# EAGLE schematic MPPT3 (EAGLE 7.2.0)
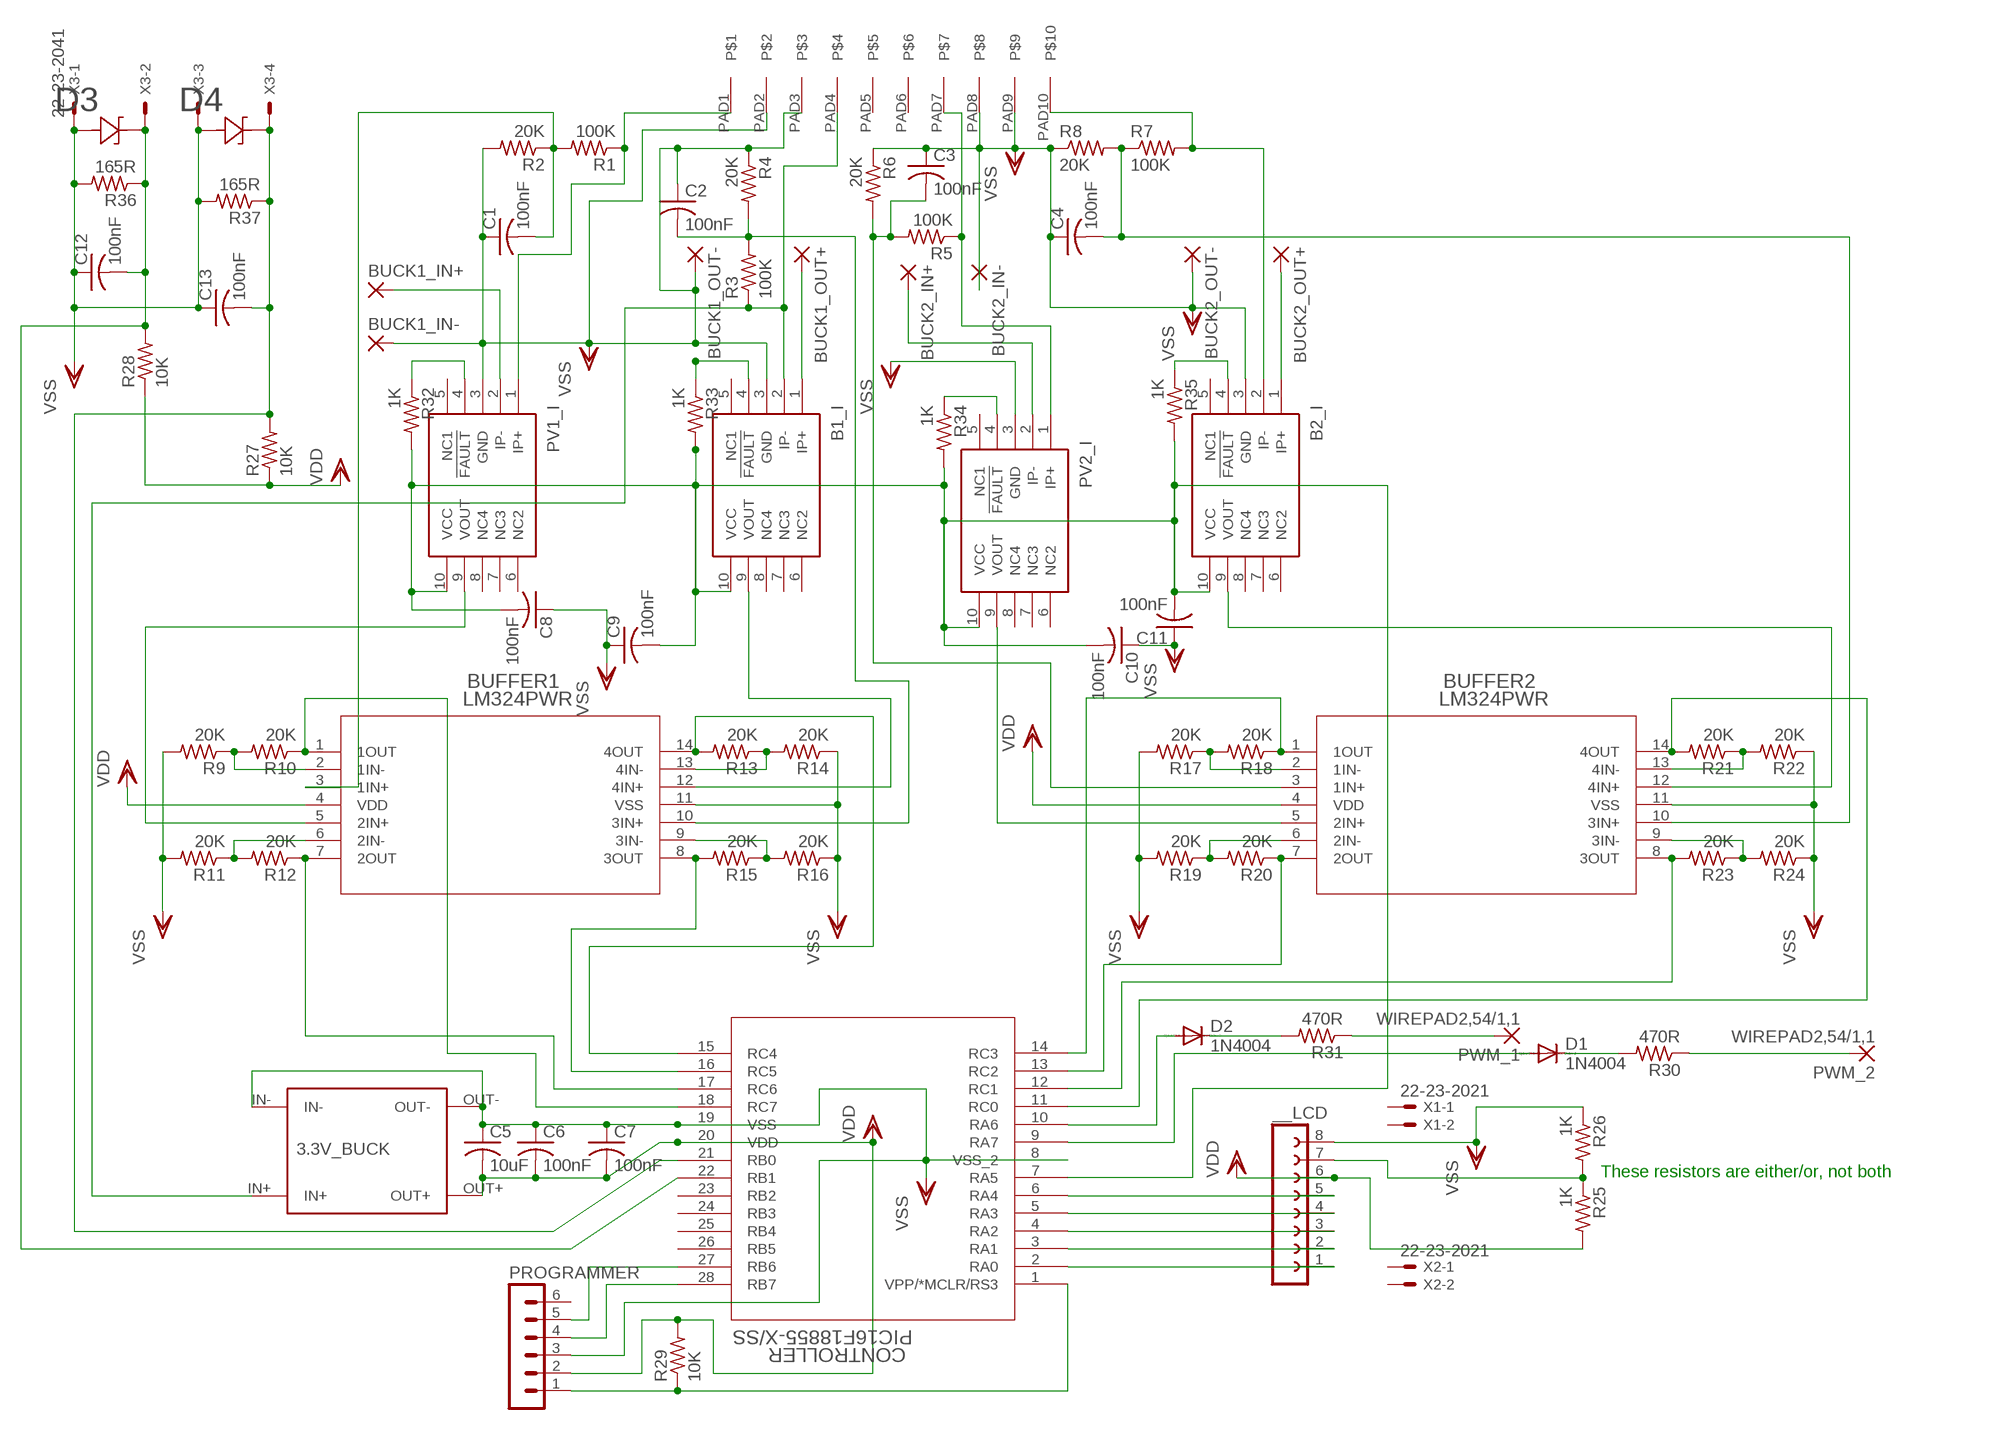
[diagram p0: schematic, sheet 1]

## Parts
3.3V_BUCK  TINY_BUCK  [TINY_BUCK]
__LCD  FE08-1  [FE08]
B1_I  ACS711KEXLT-15AB-T  [EX-PACKAGE]
B2_I  ACS711KEXLT-15AB-T  [EX-PACKAGE]
BUCK1_IN+  3,81/1,4  [3,81/1,4]
BUCK1_IN-  3,81/1,4  [3,81/1,4]
BUCK1_OUT+  3,81/1,4  [3,81/1,4]
BUCK1_OUT-  3,81/1,4  [3,81/1,4]
BUCK2_IN+  3,81/1,4  [3,81/1,4]
BUCK2_IN-  3,81/1,4  [3,81/1,4]
BUCK2_OUT+  3,81/1,4  [3,81/1,4]
BUCK2_OUT-  3,81/1,4  [3,81/1,4]
BUFFER1  LM324PWR  [PW14]
BUFFER2  LM324PWR  [PW14]
C1  100nF  C-USC0603  [C0603]
C2  100nF  C-USC0603  [C0603]
C3  100nF  C-USC0603  [C0603]
C4  100nF  C-USC0603  [C0603]
C5  10uF  C-USC0603  [C0603]
C6  100nF  C-USC0603  [C0603]
C7  100nF  C-USC0603  [C0603]
C8  100nF  C-USC0603  [C0603]
C9  100nF  C-USC0603  [C0603]
C10  100nF  C-USC0603  [C0603]
C11  100nF  C-USC0603  [C0603]
C12  100nF  C-USC0603  [C0603]
C13  100nF  C-USC0603  [C0603]
CONTROLLER  PIC16F18855-X/SS  [SSOP28_MC]
D1  1N4004  [DO41-10]
D2  1N4004  [DO41-10]
D3  CZRU52C3V3  [CZRU]
D4  CZRU52C3V3  [CZRU]
PROGRAMMER  MA06-1  [MA06-1]
PV1_I  ACS711KEXLT-15AB-T  [EX-PACKAGE]
PV2_I  ACS711KEXLT-15AB-T  [EX-PACKAGE]
PWM_1  WIREPAD2,54/1,1  [2,54/1,1]
PWM_2  WIREPAD2,54/1,1  [2,54/1,1]
R1  100K  R-US_R0603  [R0603]
R2  20K  R-US_R0603  [R0603]
R3  100K  R-US_R0603  [R0603]
R4  20K  R-US_R0603  [R0603]
R5  100K  R-US_R0603  [R0603]
R6  20K  R-US_R0603  [R0603]
R7  100K  R-US_R0603  [R0603]
R8  20K  R-US_R0603  [R0603]
R9  20K  R-US_R0603  [R0603]
R10  20K  R-US_R0603  [R0603]
R11  20K  R-US_R0603  [R0603]
R12  20K  R-US_R0603  [R0603]
R13  20K  R-US_R0603  [R0603]
R14  20K  R-US_R0603  [R0603]
R15  20K  R-US_R0603  [R0603]
R16  20K  R-US_R0603  [R0603]
R17  20K  R-US_R0603  [R0603]
R18  20K  R-US_R0603  [R0603]
R19  20K  R-US_R0603  [R0603]
R20  20K  R-US_R0603  [R0603]
R21  20K  R-US_R0603  [R0603]
R22  20K  R-US_R0603  [R0603]
R23  20K  R-US_R0603  [R0603]
R24  20K  R-US_R0603  [R0603]
R25  1K  R-US_R0603  [R0603]
R26  1K  R-US_R0603  [R0603]
R27  10K  R-US_R1206  [R1206]
R28  10K  R-US_R0603  [R0603]
R29  10K  R-US_R0603  [R0603]
R30  470R  R-US_R0603  [R0603]
R31  470R  R-US_R1206  [R1206]
R32  1K  R-US_R1206  [R1206]
R33  1K  R-US_R1206  [R1206]
R34  1K  R-US_R0603  [R0603]
R35  1K  R-US_R0603  [R0603]
R36  165R  R-US_R0603  [R0603]
R37  165R  R-US_R0603  [R0603]
U$1  CONN-KF2EDG-10(5.08)E-BAYPLUGGABLECONNECTORS  [CONN-KF2EDG-10(5.08)]
X1  22-23-2021  [22-23-2021]
X2  22-23-2021  [22-23-2021]
X3  22-23-2041  [22-23-2041]

## Nets
N$1: BUCK1_IN+.1(P) PV1_I.2(IP-)
N$2: BUFFER1.5(2IN+) PV1_I.9(VOUT)
N$3: BUFFER1.3(1IN+) C1.2 R1.2 R2.1
N$4: PV1_I.4(!FAULT) R32.1
N$5: BUFFER1.10(3IN+) C2.2 R3.2 R4.2
N$6: 3.3V_BUCK.IN+ B1_I.2(IP-) R3.1 U$1.PAD4
N$7: B1_I.9(VOUT) BUFFER1.12(4IN+)
N$8: PV2_I.1(IP+) R5.1 U$1.PAD7
N$9: BUCK2_IN+.1(P) PV2_I.2(IP-)
N$10: B1_I.4(!FAULT) R33.1
N$11: B2_I.2(IP-) R7.2 U$1.PAD10
N$12: BUFFER2.10(3IN+) C4.2 R7.1 R8.2
N$13: B2_I.1(IP+) BUCK2_OUT+.1(P)
N$14: BUFFER1.9(3IN-) R15.1 R16.2
N$15: BUFFER1.1(1OUT) CONTROLLER.18(RC7) R10.1
N$16: BUFFER1.6(2IN-) R11.1 R12.2
N$17: BUFFER1.7(2OUT) CONTROLLER.17(RC6) R12.1
N$18: BUFFER1.13(4IN-) R13.1 R14.2
N$19: BUFFER1.2(1IN-) R9.1 R10.2
N$20: BUFFER1.14(4OUT) CONTROLLER.15(RC4) R13.2
N$21: BUFFER1.8(3OUT) CONTROLLER.16(RC5) R15.2
N$22: B1_I.1(IP+) BUCK1_OUT+.1(P)
N$23: __LCD.1 CONTROLLER.2(RA0)
N$24: BUFFER2.1(1OUT) CONTROLLER.14(RC3) R18.1
N$25: BUFFER2.7(2OUT) CONTROLLER.13(RC2) R20.1
N$26: BUFFER2.6(2IN-) R19.1 R20.2
N$27: BUFFER2.14(4OUT) CONTROLLER.11(RC0) R21.2
N$28: BUFFER2.13(4IN-) R21.1 R22.2
N$29: BUFFER2.8(3OUT) CONTROLLER.12(RC1) R23.2
N$30: BUFFER2.9(3IN-) R23.1 R24.2
N$31: BUFFER2.2(1IN-) R17.1 R18.2
N$32: BUFFER2.5(2IN+) PV2_I.9(VOUT)
N$33: B2_I.9(VOUT) BUFFER2.12(4IN+)
N$34: __LCD.2 CONTROLLER.3(RA1)
N$35: __LCD.3 CONTROLLER.4(RA2)
N$36: __LCD.4 CONTROLLER.5(RA3)
N$37: __LCD.5 CONTROLLER.6(RA4)
N$38: __LCD.7 R25.1 R26.2
N$39: C12.2 CONTROLLER.22(RB1) D3.1 R28.2 R36.1 X3.2
N$40: CONTROLLER.1(VPP/*MCLR/RS3) PROGRAMMER.1 R29.1
N$41: CONTROLLER.10(RA6) D2.A
N$42: C13.2 CONTROLLER.21(RB0) D4.1 R27.2 R37.1 X3.4
N$43: CONTROLLER.9(RA7) D1.A
N$44: CONTROLLER.28(RB7) PROGRAMMER.4
N$45: CONTROLLER.27(RB6) PROGRAMMER.5
N$46: PWM_2.1(P) R30.1
N$47: D1.C R30.2
N$48: PWM_1.1(P) R31.1
N$49: D2.C R31.2
N$50: PV1_I.1(IP+) R1.1 U$1.PAD1
N$51: PV2_I.4(!FAULT) R34.1
N$52: BUFFER2.3(1IN+) C3.2 R5.2 R6.2
N$53: B1_I.10(VCC) B2_I.10(VCC) C8.2 C9.2 C10.2 C11.2 CONTROLLER.7(RA5) PV1_I.10(VCC) PV2_I.10(VCC) R32.2 R33.2 R34.2 R35.2
N$56: B2_I.4(!FAULT) R35.1
VDD: 3.3V_BUCK.OUT+ __LCD.6 BUFFER1.4(VDD) BUFFER2.4(VDD) C5.2 C6.2 C7.2 CONTROLLER.20(VDD) PROGRAMMER.2 R25.2 R27.1 R28.1 R29.2
VSS: 3.3V_BUCK.IN- 3.3V_BUCK.OUT- __LCD.8 B1_I.3(GND) B2_I.3(GND) BUCK1_IN-.1(P) BUCK1_OUT-.1(P) BUCK2_IN-.1(P) BUCK2_OUT-.1(P) BUFFER1.11(VSS) BUFFER2.11(VSS) C1.1 C2.1 C3.1 C4.1 C5.1 C6.1 C7.1 C8.1 C9.1 C10.1 C11.1 C12.1 C13.1 CONTROLLER.8(VSS_2) CONTROLLER.19(VSS) D3.2 D4.2 PROGRAMMER.3 PV1_I.3(GND) PV2_I.3(GND) R2.2 R4.1 R6.1 R8.1 R9.2 R11.2 R14.1 R16.1 R17.2 R19.2 R22.1 R24.1 R26.1 R36.2 R37.2 U$1.PAD2 U$1.PAD3 U$1.PAD8 U$1.PAD9 X3.1 X3.3
Unconnected: B1_I.5(NC1) B1_I.6(NC2) B1_I.7(NC3) B1_I.8(NC4) B2_I.5(NC1) B2_I.6(NC2) B2_I.7(NC3) B2_I.8(NC4) CONTROLLER.23(RB2) CONTROLLER.24(RB3) CONTROLLER.25(RB4) CONTROLLER.26(RB5) PROGRAMMER.6 PV1_I.5(NC1) PV1_I.6(NC2) PV1_I.7(NC3) PV1_I.8(NC4) PV2_I.5(NC1) PV2_I.6(NC2) PV2_I.7(NC3) PV2_I.8(NC4) U$1.PAD5 U$1.PAD6 X1.1 X1.2 X2.1 X2.2

## Notes on the sheet
- These resistors are either/or, not both

## Library data of the parts
3.3V_BUCK = Tiny_Buck:TINY_BUCK: E_Bay 3 Amp Buck Converter
__LCD = con-lsta:FE08-1: FEMALE HEADER; OC_FARNELL: unknown; OC_NEWARK: unknown
B1_I B2_I PV1_I PV2_I = SamacSys_Parts:ACS711KEXLT-15AB-T: Hall Effect Linear Current Sensor with Overcurrent Fault Output for <100 V Isolation Applications Source: Datasheet <https://www.arrow.com/en/products/acs711kexlt-15ab-t/allegro-microsystems>; ARROW_PART_NUMBER: ACS711KEXLT-15AB-T; DESCRIPTION: Hall Effect Linear Current Sensor with Overcurrent Fault Output for <100 V Isolation Applications; HEIGHT: mm; MANUFACTURER_NAME: Allegro Microsystems; MANUFACTURER_PART_NUMBER: ACS711KEXLT-15AB-T
BUCK1_IN+ BUCK1_IN- BUCK1_OUT+ BUCK1_OUT- BUCK2_IN+ BUCK2_IN- BUCK2_OUT+ BUCK2_OUT- = wirepad:3,81/1,4: THROUGH-HOLE PAD
BUFFER1 BUFFER2 = LM324PWR:LM324PWR; MANUFACTURER_PART_NUMBER: LM324PWR; VENDOR: Vendor
C1-C13 = resistor:C-US: CAPACITOR, American symbol
CONTROLLER = 16F18855_SSOP:PIC16F18855-X/SS; COPYRIGHT: Copyright (C) 2016 Accelerated Designs. All rights reserved; MANUFACTURER_PART_NUMBER: pic16f18855-x/ss; VENDOR: Microchip
D1 D2 = diode:1N4004: DIODE general purpose rectifier, 1 A
D3 D4 = 0603ZenerDiode:CZRU52C3V3; VENDOR: Comchip
PROGRAMMER = con-lstb:MA06-1: PIN HEADER; OC_FARNELL: unknown; OC_NEWARK: unknown
PWM_1 PWM_2 = wirepad:WIREPAD: Wire PAD connect wire on PCB
R1-R26 R28-R37 = resistor:R-US_: RESISTOR, American symbol
R27 = rcl:R-US_: RESISTOR, American symbol
U$1 = Stuff_I_Use:CONN-KF2EDG-10(5.08)
X1 X2 = con-molex:22-23-2021: .100" (2.54mm) Center Header - 2 Pin; MF: MOLEX; MPN: 22-23-2021; OC_FARNELL: 1462926; OC_NEWARK: 25C3832
X3 = con-molex:22-23-2041: .100" (2.54mm) Center Header - 4 Pin; MF: MOLEX; MPN: 22-23-2041; OC_FARNELL: 1462920; OC_NEWARK: 38C0355